# Altium project Electrode_Array_Hex.PrjPcb
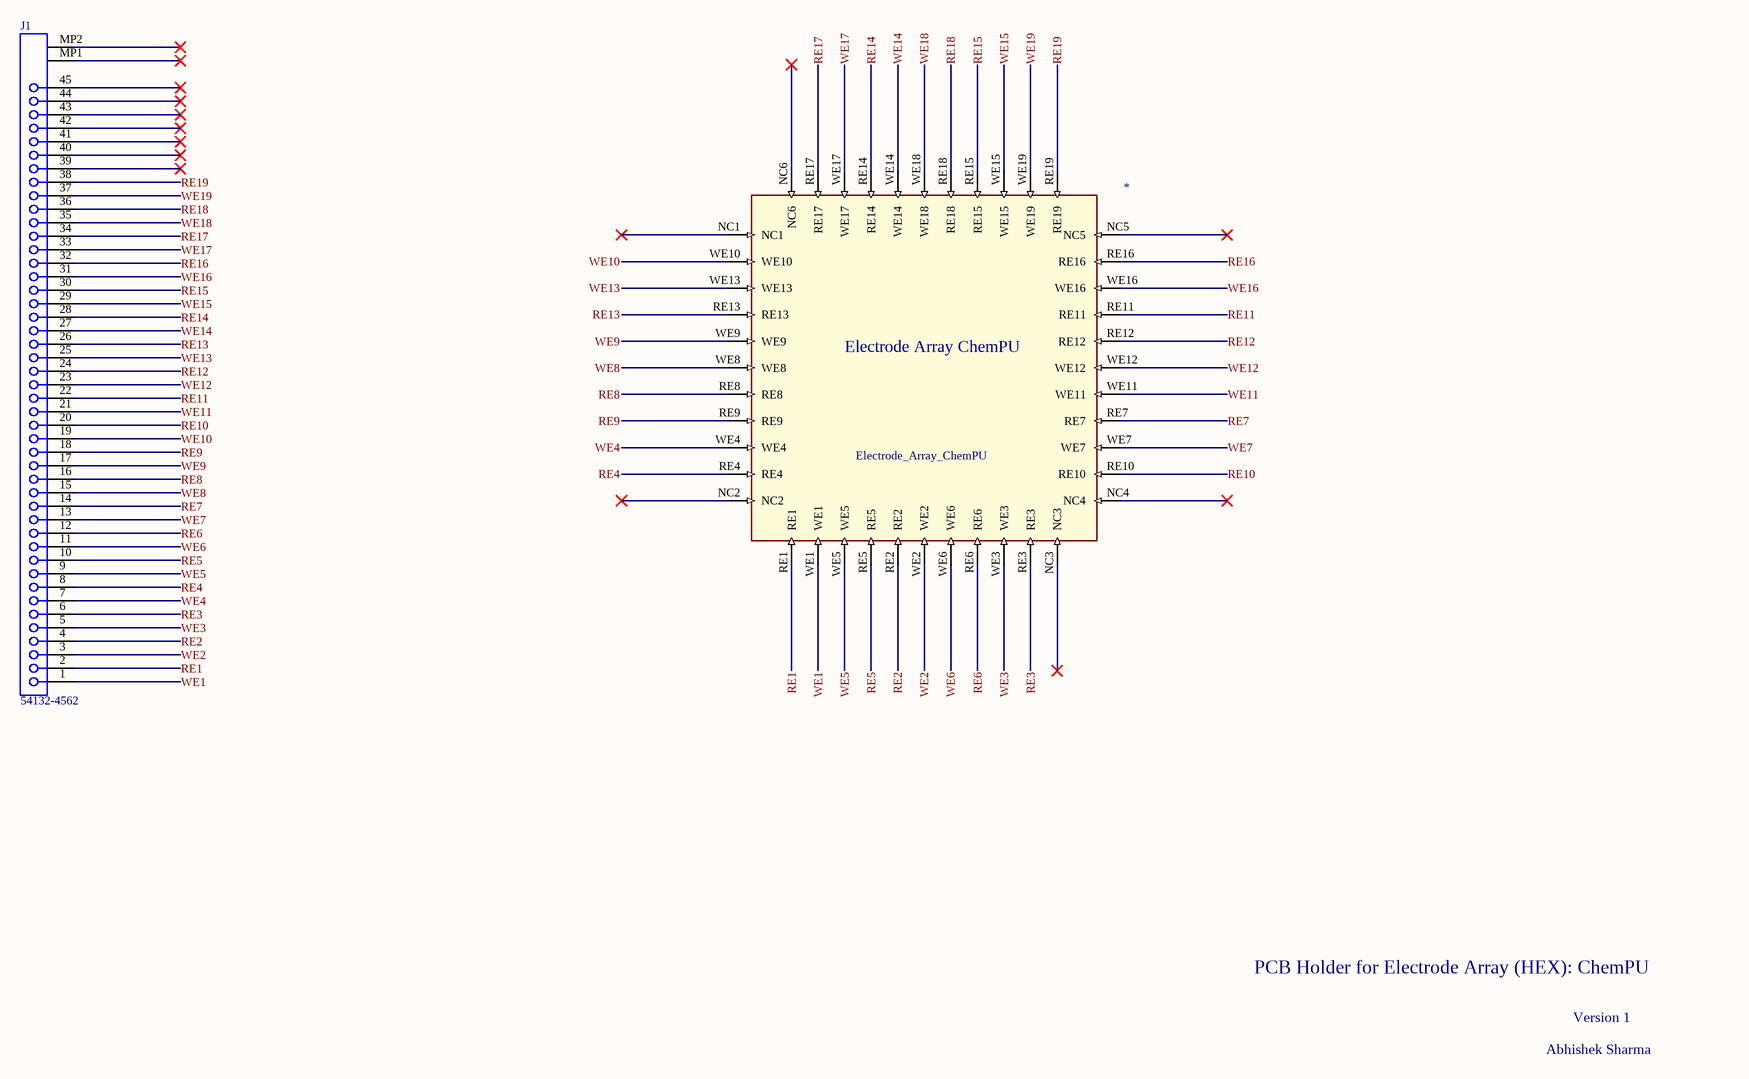
[diagram p0: Electrode_Array_Hex.SchDoc]
1 sheet, 2 parts. Net scope: global (net labels, ports and power ports of the same name join across sheets).
Board file: Electrode_Array_Hex.PcbDoc

## Sheet Electrode_Array_Hex.SchDoc
size A3; SheetNumber: 1; SheetTotal: 1

### Parts
*  Electrode_Array_ChemPU  [PCBComponent_1]
J1  54132-4562  [MOLX-54132-4562]

### Nets
RE1: *.RE1 J1.2
RE2: *.RE2 J1.4
RE3: *.RE3 J1.6
RE4: *.RE4 J1.8
RE5: *.RE5 J1.10
RE6: *.RE6 J1.12
RE7: *.RE7 J1.14
RE8: *.RE8 J1.16
RE9: *.RE9 J1.18
RE10: *.RE10 J1.20
RE11: *.RE11 J1.22
RE12: *.RE12 J1.24
RE13: *.RE13 J1.26
RE14: *.RE14 J1.28
RE15: *.RE15 J1.30
RE16: *.RE16 J1.32
RE17: *.RE17 J1.34
RE18: *.RE18 J1.36
RE19: *.RE19 J1.38
WE1: *.WE1 J1.1
WE2: *.WE2 J1.3
WE3: *.WE3 J1.5
WE4: *.WE4 J1.7
WE5: *.WE5 J1.9
WE6: *.WE6 J1.11
WE7: *.WE7 J1.13
WE8: *.WE8 J1.15
WE9: *.WE9 J1.17
WE10: *.WE10 J1.19
WE11: *.WE11 J1.21
WE12: *.WE12 J1.23
WE13: *.WE13 J1.25
WE14: *.WE14 J1.27
WE15: *.WE15 J1.29
WE16: *.WE16 J1.31
WE17: *.WE17 J1.33
WE18: *.WE18 J1.35
WE19: *.WE19 J1.37

Not connected (* = marked no-connect by the designer): * NC1* NC2* NC3* NC4* NC5* NC6*; J1 39* 40* 41* 42* 43* 44* 45* MP1* MP2*

### Notes on the sheet
- PCB Holder for Electrode Array (HEX): ChemPU
- Version 1
- Abhishek Sharma
- (in symbol Component_1) Electrode Array ChemPU

### Library data of the parts
* = Component_1
J1 = CMP-1241-00535-1: 0.5 mm Pitch Easy-On(TM) Type FPC Connector, 2.0 mm Mated Height, Right Angle, ZIF, SMT, Bottom Contact, 45 Circuits, -20 to 85 degC, ELV and RoHS Compliant, Tape and Reel; Manufacturer: Molex; PCB Retention: Yes; Material - Plating Termination: Gold; Mated Height: 2.00mm; Circuits (Loaded): 45; Stackable: No; Voltage (Max): 50V; Durability (mating cycles max): 20; Pitch - Mating Interface: 0.50mm; Current (Max per Contact): 0.5A; Entry Angle: 90degrees Angle; Material - Metal: Phosphor Bronze; ComponentLink1Description: Manufacturer URL; PackageVersion: Rev. F, 07/2010; ComponentLink3Description: Package Specification; Packing: Tape and Reel; PackageReference: 54132-4562; ComponentLink2Description: Datasheet; Material - Plating Mating: Gold; Contact Position: Bottom; PackageDescription: 45-Lead FPC Connector, Pitch 0.5 mm; ComponentLink1URL: http://www.molex.com/molex/index.jsp; Polarized to PCB: Yes; Mounting Technology: Surface Mount; RoHS: TRUE; PCB Locator: No; Number of Rows: 1; ComponentLink3URL: http://www.molex.com/pdm_docs/sd/541324562_sd.pdf; ComponentLink2URL: http://www.molex.com/webdocs/datasheets/pdf/en-us/0541324562_FFC_FPC_CONNECTORS.pdf; Orientation: Right Angle; PartNumber: 54132-4562